# EAGLE schematic 0351_AD_ConverterRev020000 (EAGLE 9.6.2)
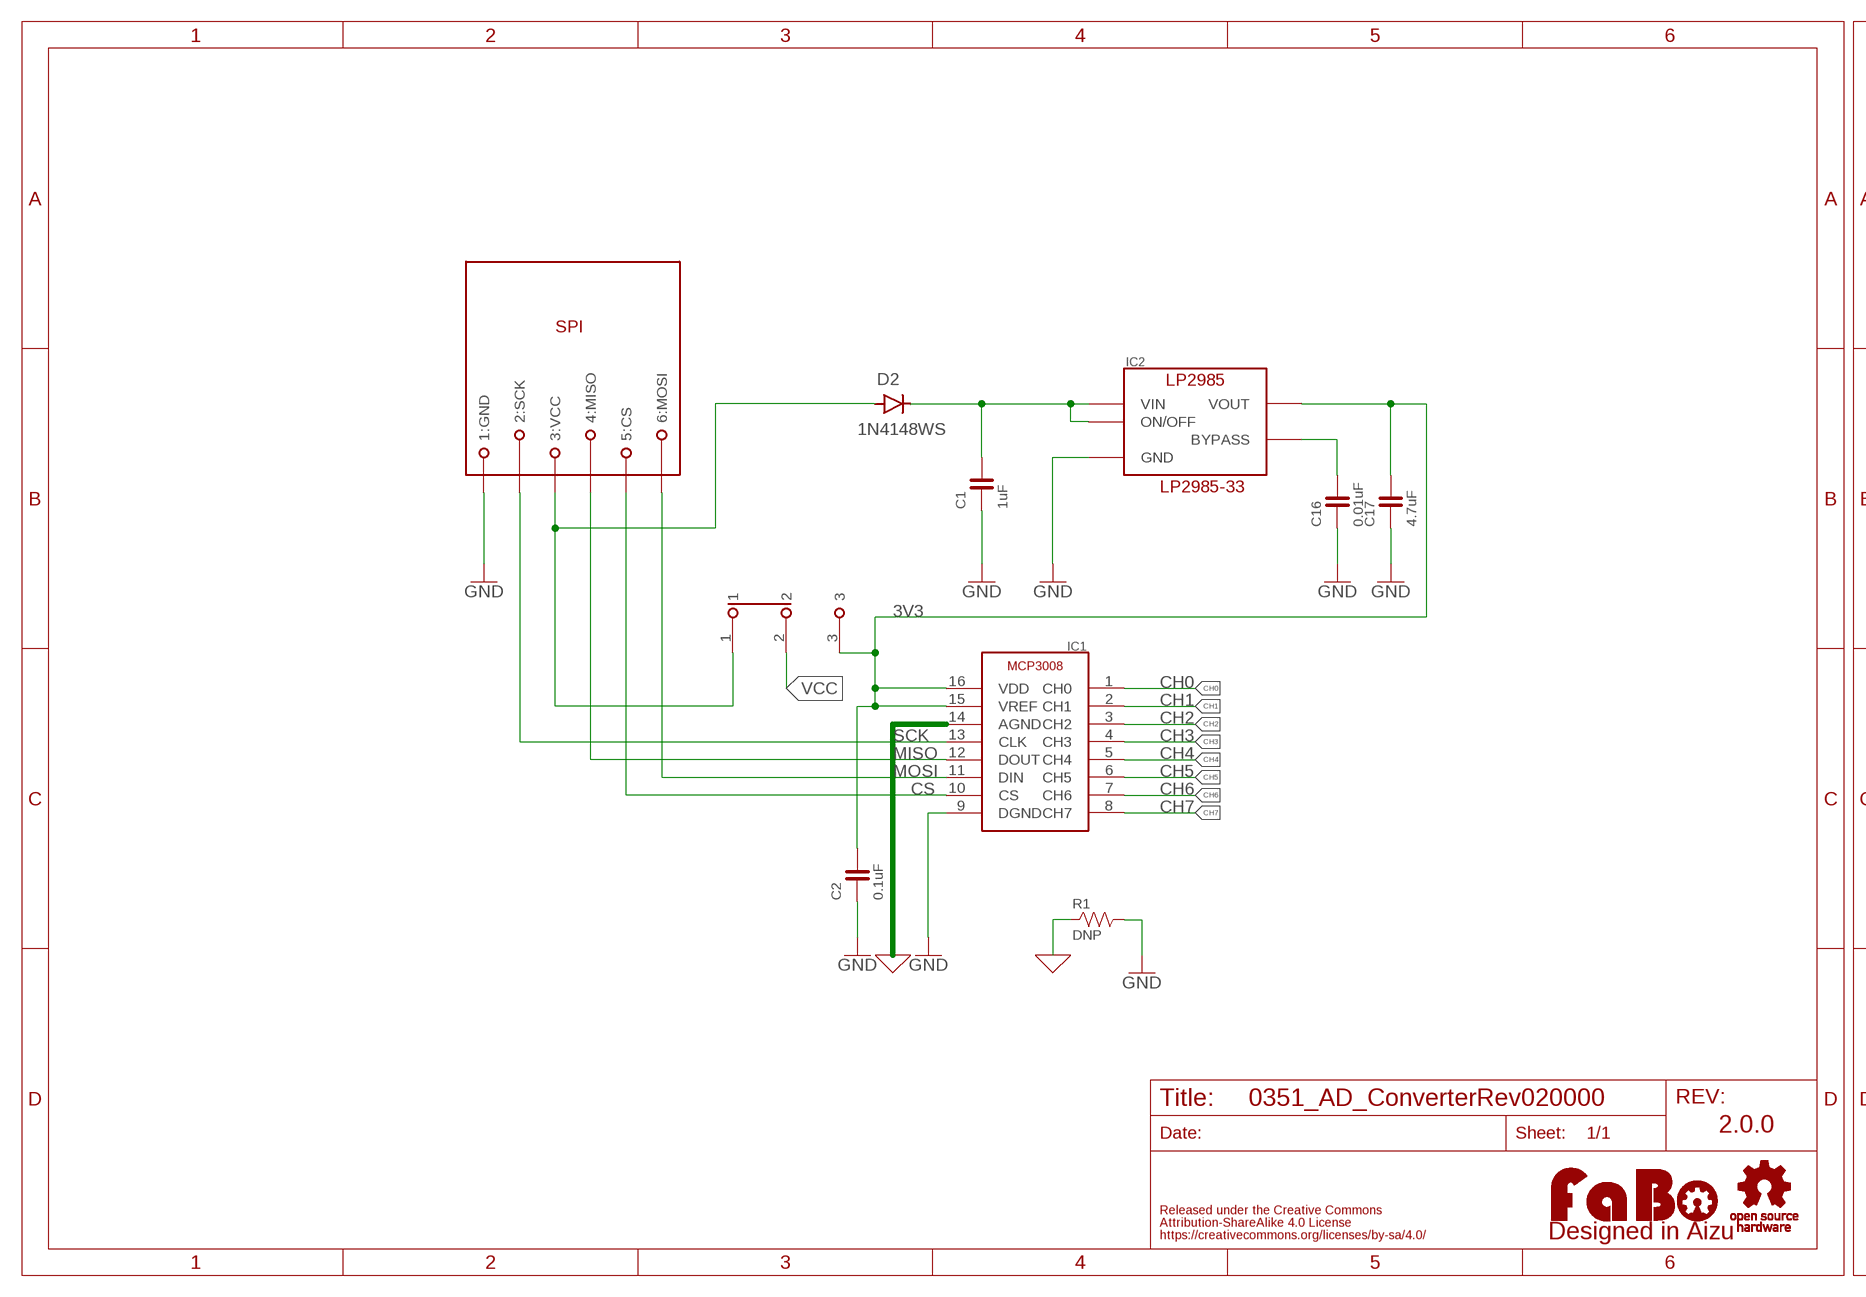
[diagram p0: schematic, sheet 1, part 1 of 2]
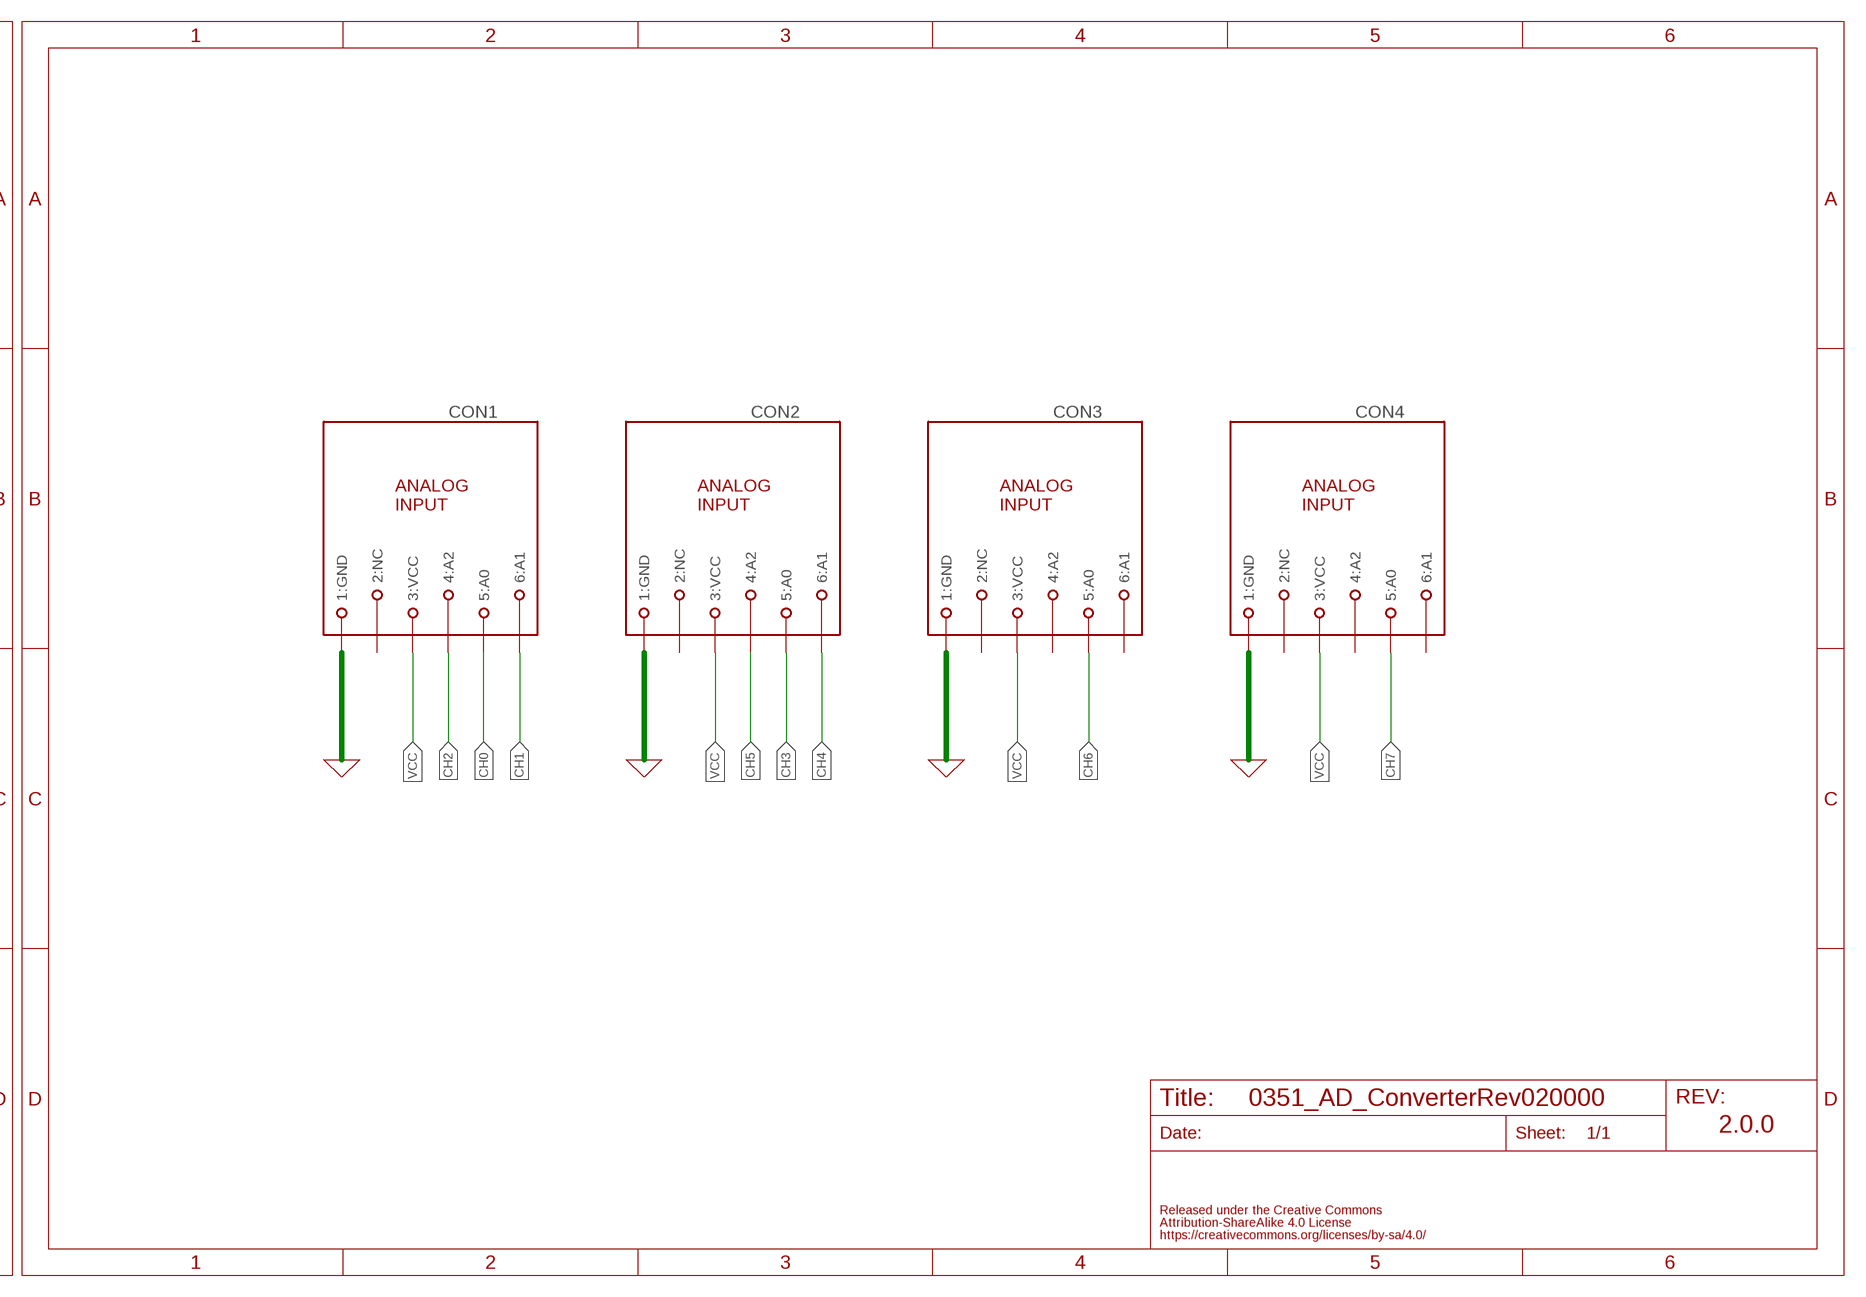
[diagram p1: schematic, sheet 1, part 2 of 2]

## Parts
C1  1uF  CAPACITOR-0603  [0603]
C2  0.1uF  CAPACITOR-0603  [0603]
C16  0.01uF  CAPACITOR-0603  [0603]
C17  4.7uF  CAPACITOR-0603  [0603]
CON1  MODULAR-JACK-6P-RJ11_ANALOG3  [7002-6PXC-X]
CON2  MODULAR-JACK-6P-RJ11_ANALOG3  [7002-6PXC-X]
CON3  MODULAR-JACK-6P-RJ11_ANALOG3  [7002-6PXC-X]
CON4  MODULAR-JACK-6P-RJ11_ANALOG3  [7002-6PXC-X]
D2  1N4148WS  [SOD-323]
IC1  MICROCHIP-MCP3008  [MICROCHIP-MCP3008]
IC2  LP2985-33DBV  [SOT-23-5]
LCD-SPI_RJ11  MODULAR-JACK-6P-RJ11_SPI  [7002-6PXC-X]
LOGO1  LOGO_FABO-M_BOTTOM  [LOGO_FABO_M_BOTTOM]
R1  DNP  RESISTOR-0805  [0805]
U$3  LOGO_OSHW-M_BOTTOM  [LOGO_OSHW_M_BOTTOM]
U$5  SSSS213202  [SSSS213202]

## Nets
0: CON1.1(1:GND) CON2.1(1:GND) CON3.1(1:GND) CON4.1(1:GND) IC1.14(AGND) R1.1 ; supply symbol labelled GND
3V3: C2.2 C17.2 IC1.15(VREF) IC1.16(VDD) IC2.5(VOUT) U$5.3
CH0: CON1.5(5:A0) IC1.1(CH0)
CH1: CON1.6(6:A1) IC1.2(CH1)
CH2: CON1.4(4:A2) IC1.3(CH2)
CH3: CON2.5(5:A0) IC1.4(CH3)
CH4: CON2.6(6:A1) IC1.5(CH4)
CH5: CON2.4(4:A2) IC1.6(CH5)
CH6: CON3.5(5:A0) IC1.7(CH6)
CH7: CON4.5(5:A0) IC1.8(CH7)
CS: IC1.10(CS) LCD-SPI_RJ11.5(5:CS)
GND: C1.1 C2.1 C16.1 C17.1 IC1.9(DGND) IC2.2(GND) LCD-SPI_RJ11.1(1:GND) R1.2
MISO: IC1.12(DOUT) LCD-SPI_RJ11.4(4:MISO)
MOSI: IC1.11(DIN) LCD-SPI_RJ11.6(6:MOSI)
N$7: C16.2 IC2.4(BYPASS)
N$8: C1.2 D2.C IC2.1(VIN) IC2.3(ON/OFF)
SCK: IC1.13(CLK) LCD-SPI_RJ11.2(2:SCK)
VCC: CON1.3(3:VCC) CON2.3(3:VCC) CON3.3(3:VCC) CON4.3(3:VCC) U$5.2
VCC_IN: D2.A LCD-SPI_RJ11.3(3:VCC) U$5.1
Unconnected: CON1.2(2:NC) CON2.2(2:NC) CON3.2(2:NC) CON3.4(4:A2) CON3.6(6:A1) CON4.2(2:NC) CON4.4(4:A2) CON4.6(6:A1)

## Notes on the sheet
- LP2985-33
- 2.0.0 | 2.0.0

## Library data of the parts
C1 C2 C16 C17 = FaBo-Capacitor:CAPACITOR: CAPACITOR
CON1 CON2 CON4 = FaBo-Connetor:MODULAR-JACK-6P-RJ11_ANALOG3
CON3 = FaBo-Connetor:MODULAR-JACK-6P-RJ11_ANALOG3; SPICEPREFIX: X
D2 = Diodes:1N4148WS: DIODE GEN PURP 75V 150MA SOD323F Manufacturer's datasheet <https://www.onsemi.com/pub/Collateral/1N914BWS-D.pdf>; CREATED_BY: PCBLayout.com; DIGIKEY_PART_NUMBER: 1N4148WSFSTR-ND; MANUFACTURER: Diodes Incorporated; MPN: 1N4148WS; PACKAGE: SOD-323
IC1 = FaBo-ADC:MICROCHIP-MCP3008
IC2 = FaBo-Supply:LP2985: LP2985
LCD-SPI_RJ11 = FaBo-Connetor:MODULAR-JACK-6P-RJ11_SPI
LOGO1 = component:LOGO_FABO
R1 = FaBo-Resistors:RESISTOR: RESISTOR
U$3 = component:LOGO_OSHW
U$5 = FaBo-Switch:SSSS213202